# Altium schematic sheet etc.SchDoc
size A4
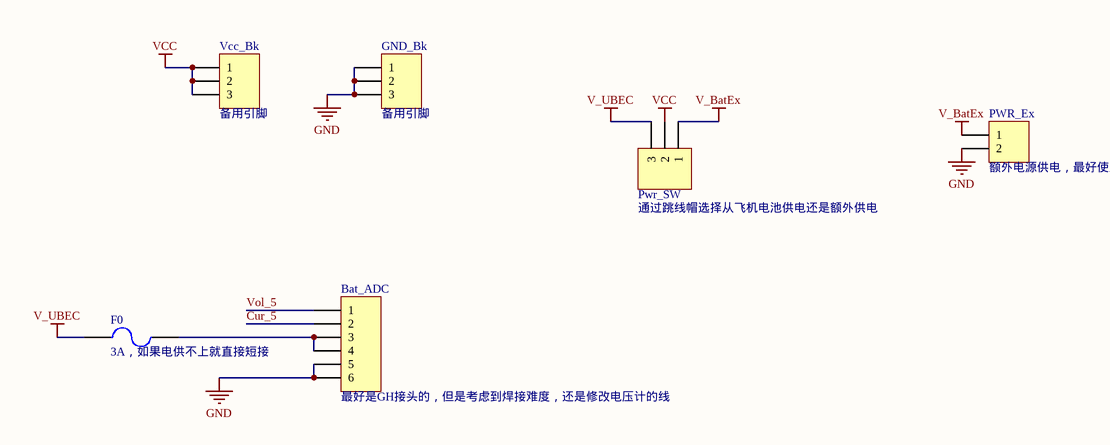
[diagram p0: etc.SchDoc]

## Parts
Bat_ADC  最好是GH接头的，但是考虑到焊接难度，还是修改电压计的线  [HDR1X6]
F0  3A，如果电供不上就直接短接  [1812]
GND_Bk  备用引脚  [HDR1X3]
PWR_Ex  额外电源供电，最好使用接线端子  [HDR1X2]
Pwr_SW  通过跳线帽选择从飞机电池供电还是额外供电  [HDR1X3]
Vcc_Bk  备用引脚  [HDR1X3]

## Nets
GND: Bat_ADC.5 Bat_ADC.6 GND_Bk.1 GND_Bk.2 GND_Bk.3 PWR_Ex.2
V_BatEx: PWR_Ex.1 Pwr_SW.1
V_UBEC: F0.1 Pwr_SW.3
VCC: Pwr_SW.2 Vcc_Bk.1 Vcc_Bk.2 Vcc_Bk.3
Cur_5: Bat_ADC.2
Vol_5: Bat_ADC.1
NetBat_ADC_3: Bat_ADC.3 Bat_ADC.4 F0.2

## Library data of the parts
Bat_ADC = Header 6: Header, 6-Pin; LatestRevisionDate: 17-Jul-2002; LatestRevisionNote: Re-released for DXP Platform.; Publisher: Altium Limited
F0 = Fuse 2: Fuse; Published: 8-Jun-2000; LatestRevisionDate: 17-Jul-2002; LatestRevisionNote: Re-released for DXP Platform.; PackageReference: PIN-W2/E2.8; Publisher: Altium Limited; PackageDescription: Thru-Hole; 2 Leads
GND_Bk Pwr_SW Vcc_Bk = Header 3: Header, 3-Pin; LatestRevisionDate: 17-Jul-2002; LatestRevisionNote: Re-released for DXP Platform.; Publisher: Altium Limited
PWR_Ex = Header 2: Header, 2-Pin; LatestRevisionDate: 17-Jul-2002; LatestRevisionNote: Re-released for DXP Platform.; Publisher: Altium Limited